# EasyEDA Pro project Test PCB Video 1.eprj

# Schematic Schematic1
Board Name: Board1; Create Date: 2026-02-24; Page Name: P1; Project Name: Test PCB Video 1; Schematic Name: Schematic1; Update Date: 2026-02-24; Company: EasyEDA.com; Page Size: A4; Version: V1.0
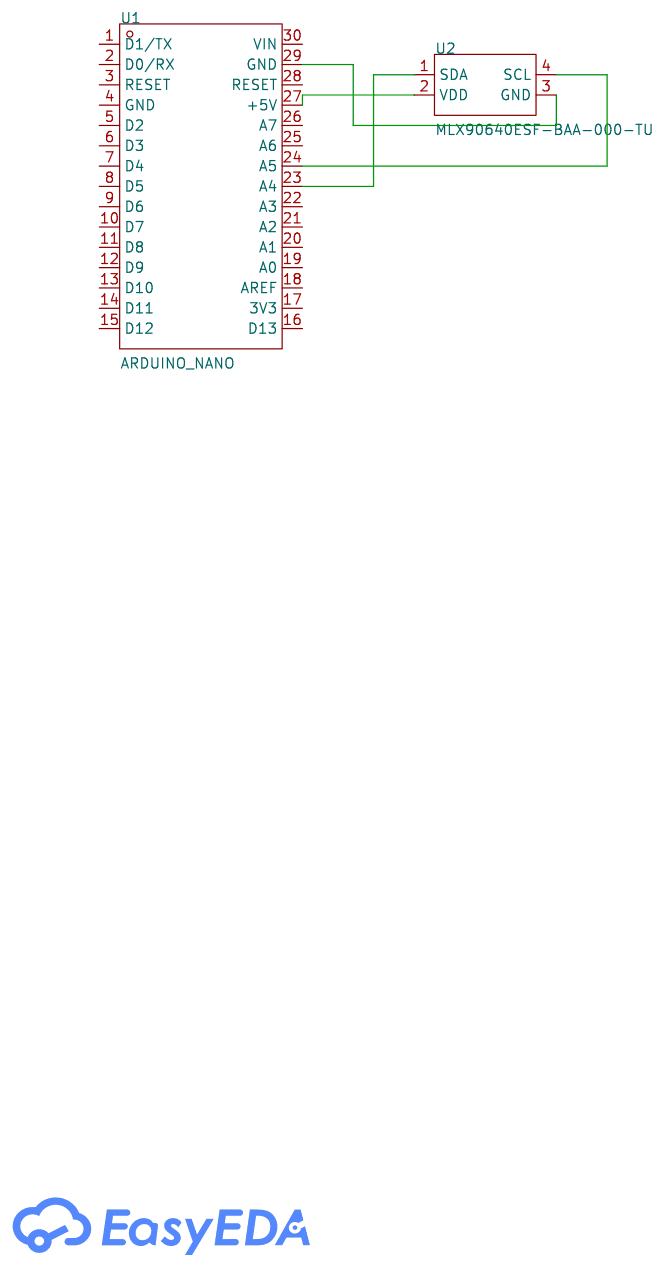
[diagram p0: schematic sheet]

## Parts
U1  ARDUINO_NANO  [COMM-TH_ARDUINO_NANO]
U2  MLX90640ESF-BAA-000-TU  [TO-39_4P-BD9.3_MLX90640ESF-BAA-000-TU_H5.7]

## Library data of the parts
U1 = ARDUINO_NANO: Supplier Part: C9900017879; Supplier Footprint: 插件; JLCPCB Part Class: Extended Part; Supplier: LCSC
U2 = MLX90640ESF-BAA-000-TU_C17380659: LCSC Part Name: 32x24 IR阵列; Supplier Part: C17380659; Manufacturer: Melexis(比利时迈来芯); Supplier Footprint: TO-39; JLCPCB Part Class: Extended Part; Datasheet: https://item.szlcsc.com/datasheet/MLX90640ESF-BAA-000-TU/18509830.html; Supplier: LCSC; Sensor Type: Thermal Sensor; Active Pixel Array: 32Hx24V; Operating Temperature: -40℃~+85℃

## Nets
$1N378: U1.29(GND) U2.3(GND)
$1N397: U1.23(A4) U2.1(SDA)
$1N402: U1.27(+5V) U2.2(VDD)
$1N420: U1.24(A5) U2.4(SCL)

Not connected (* = marked no-connect by the designer): U1 1(D1/TX) 2(D0/RX) 3(RESET) 4(GND) 5(D2) 6(D3) 7(D4) 8(D5) 9(D6) 10(D7) 11(D8) 12(D9) 13(D10) 14(D11) 15(D12) 16(D13) 17(3V3) 18(AREF) 19(A0) 20(A1) 21(A2) 22(A3) 25(A6) 26(A7) 28(RESET) 30(VIN)

# Board PCB1
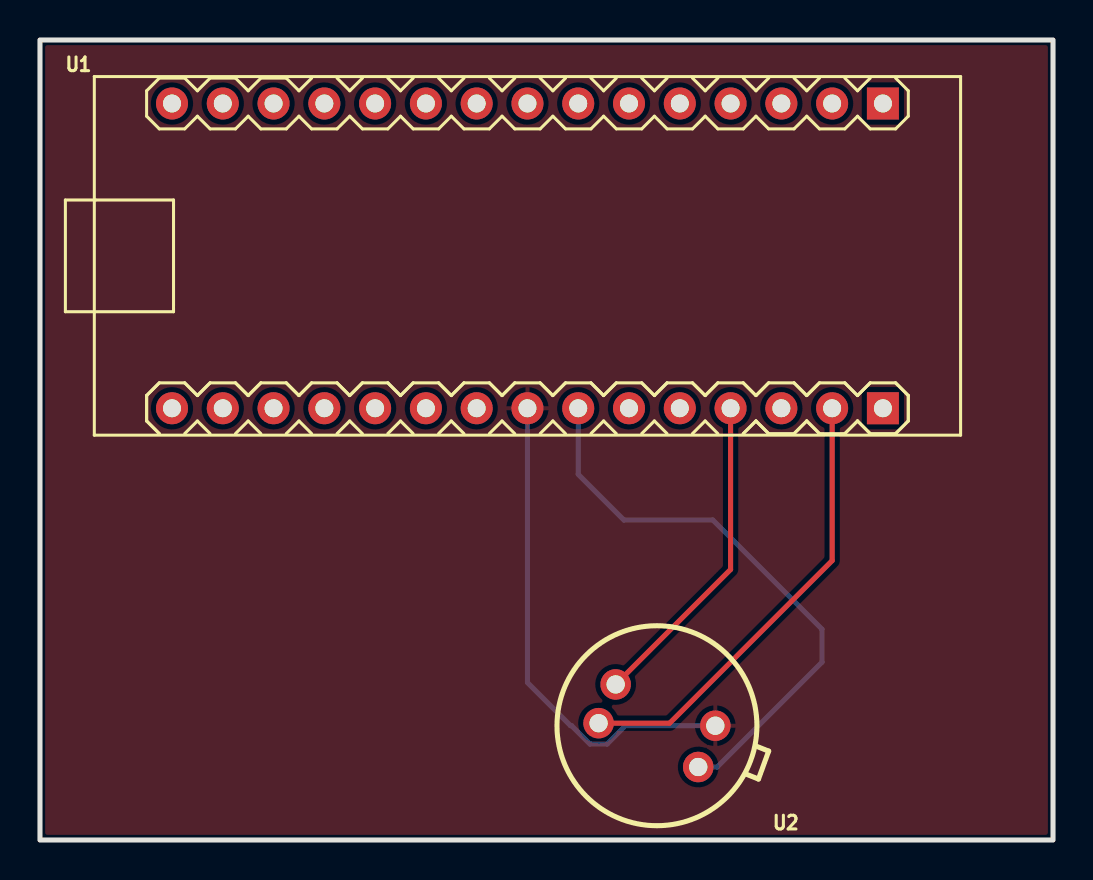
[diagram p1: board, top side]
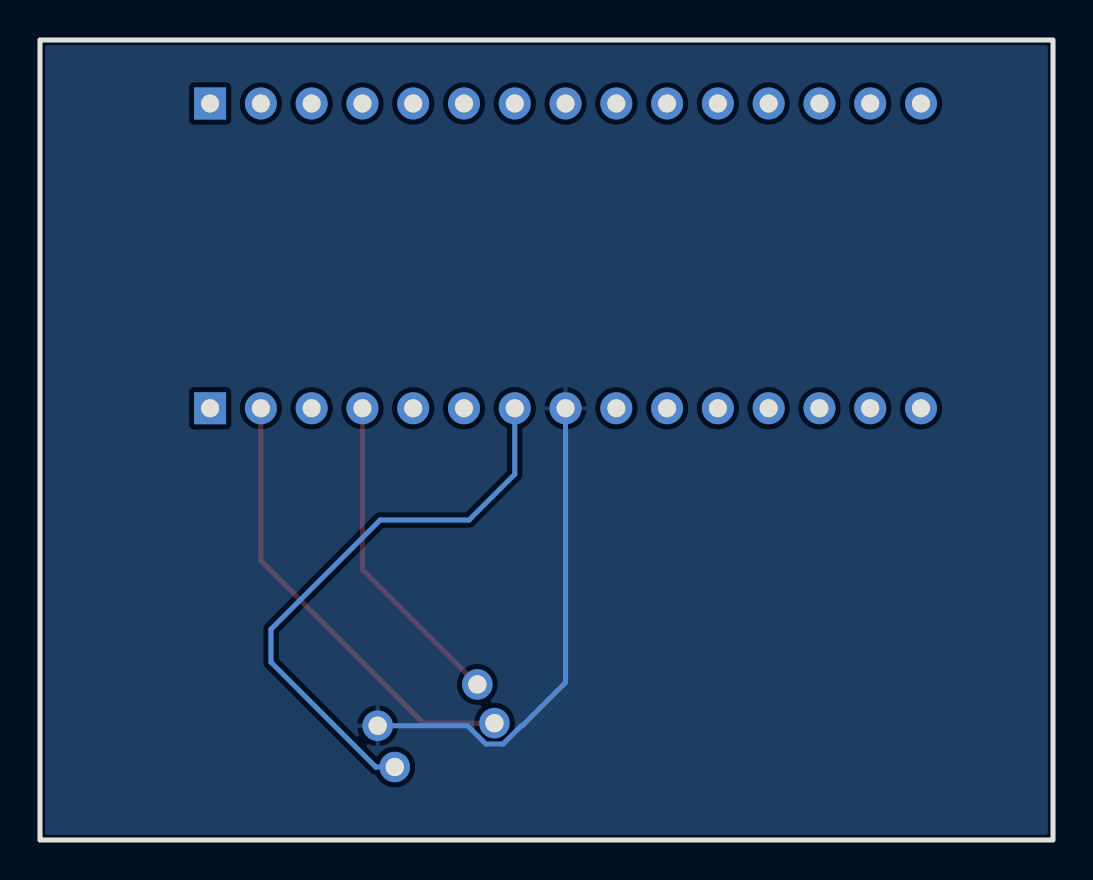
[diagram p2: board, bottom side, seen from below]

Outline 50.67 x 40.01 mm; copper layers: Top Layer, Bottom Layer. Coordinates in mm from the lower left corner of the outline.
Outline path: rectangle 0,40.01 50.67,0
Stack: Top Layer 0.035mm / Dielectric1 1.51mm FR4 er 4.5 / Bottom Layer 0.035mm

## Design rules (mm)
template: JLCPCB Capability(Two Layers Board)
spacing copperThickness1oz (default): track to track 0.102, other pairs 0.152 to 0.3
spacing copperThickness2oz: track to track 0.203, other pairs 0.152 to 0.3
track width copperThickness1oz (default): min 0.127, default 0.254, max 2.54
track width copperThickness2oz: min 0.203, default 0.254, max 2.54
differential pair differentialPair (default): width min 0.127, default 0.254, max 2.54; gap min 0.152, default 0.152
via viaSize (default): diameter min 0.5, default 0.61, max 10; hole min 0.3, default 0.305, max 6.3

## Placement (name value [footprint] x y rotation side)
U1  ARDUINO_NANO  [COMM-TH_ARDUINO_NANO]  24.38 29.21 0 top
U2  MLX90640ESF-BAA-000-TU  [TO-39_4P-BD9.3_MLX90640ESF-BAA-000-TU_H5.7]  30.86 5.72 180 top

## Footprints (pads in the part's own frame, mm; a bottom-side part is the same pattern mirrored in y, then rotated)
COMM-TH_ARDUINO_NANO
  rect 1.6x1.6 hole 0.9: 1(17.78,7.62) 30(17.78,-7.62)
  round 1.6 hole 0.9: 2(15.24,7.62) 3(12.7,7.62) 4(10.16,7.62) 5(7.62,7.62) 6(5.08,7.62) 7(2.54,7.62) 8(0,7.62) 9(-2.54,7.62) 10(-5.08,7.62) 11(-7.62,7.62) 12(-10.16,7.62) 13(-12.7,7.62) 14(-15.24,7.62) 15(-17.78,7.62) 16(-17.78,-7.62) 17(-15.24,-7.62) 18(-12.7,-7.62) 19(-10.16,-7.62) 20(-7.62,-7.62) 21(-5.08,-7.62) 22(-2.54,-7.62) 23(0,-7.62) 24(2.54,-7.62) 25(5.08,-7.62) 26(7.62,-7.62) 27(10.16,-7.62) 28(12.7,-7.62) 29(15.24,-7.62)
TO-39_4P-BD9.3_MLX90640ESF-BAA-000-TU_H5.7
  round 1.524 hole 0.914: 1(-2.92,0) 2(2.065,-2.065) 3(2.92,-0.127) 4(-2.065,2.065)

## Nets
As in the schematic.

Pads without a net: U1 1 2 3 4 5 6 7 8 9 10 11 12 13 14 15 16 17 18 19 20 21 22 25 26 28 30

## Routing (per net, layer and track width the routed paths; a pad name or vN(x,y) marks a point on that pad's centre or on a via; arc(x,y) is an arc through that point)
$1N378: length 22.7
  Top Layer w0.254: U2.3 31.5,5.84 39.62,13.97 U1.29
$1N397: length 24.8
  Bottom Layer w0.254: U1.23 24.38,7.87 26.54,5.72 26.6,5.72 27.51,4.8 28.37,4.8 29.29,5.72 33.78,5.72
$1N402: length 16.2
  Top Layer w0.254: U2.2 34.54,13.53 U1.27
$1N420: length 28.7
  Bottom Layer w0.254: U2.4 33.88,3.65 39.12,8.89 39.12,10.54 33.66,16 29.21,16 26.92,18.29 U1.24

## Copper pours and planes (outline as drawn; the poured copper is in the pictures)
$1N397 on Top Layer: 0,40.01 50.67,40.01 50.67,0 0,0
$1N397 on Bottom Layer: 0,40.01 50.67,40.01 50.67,0 0,0
